# Altium schematic sheet Key.SchDoc
size A4
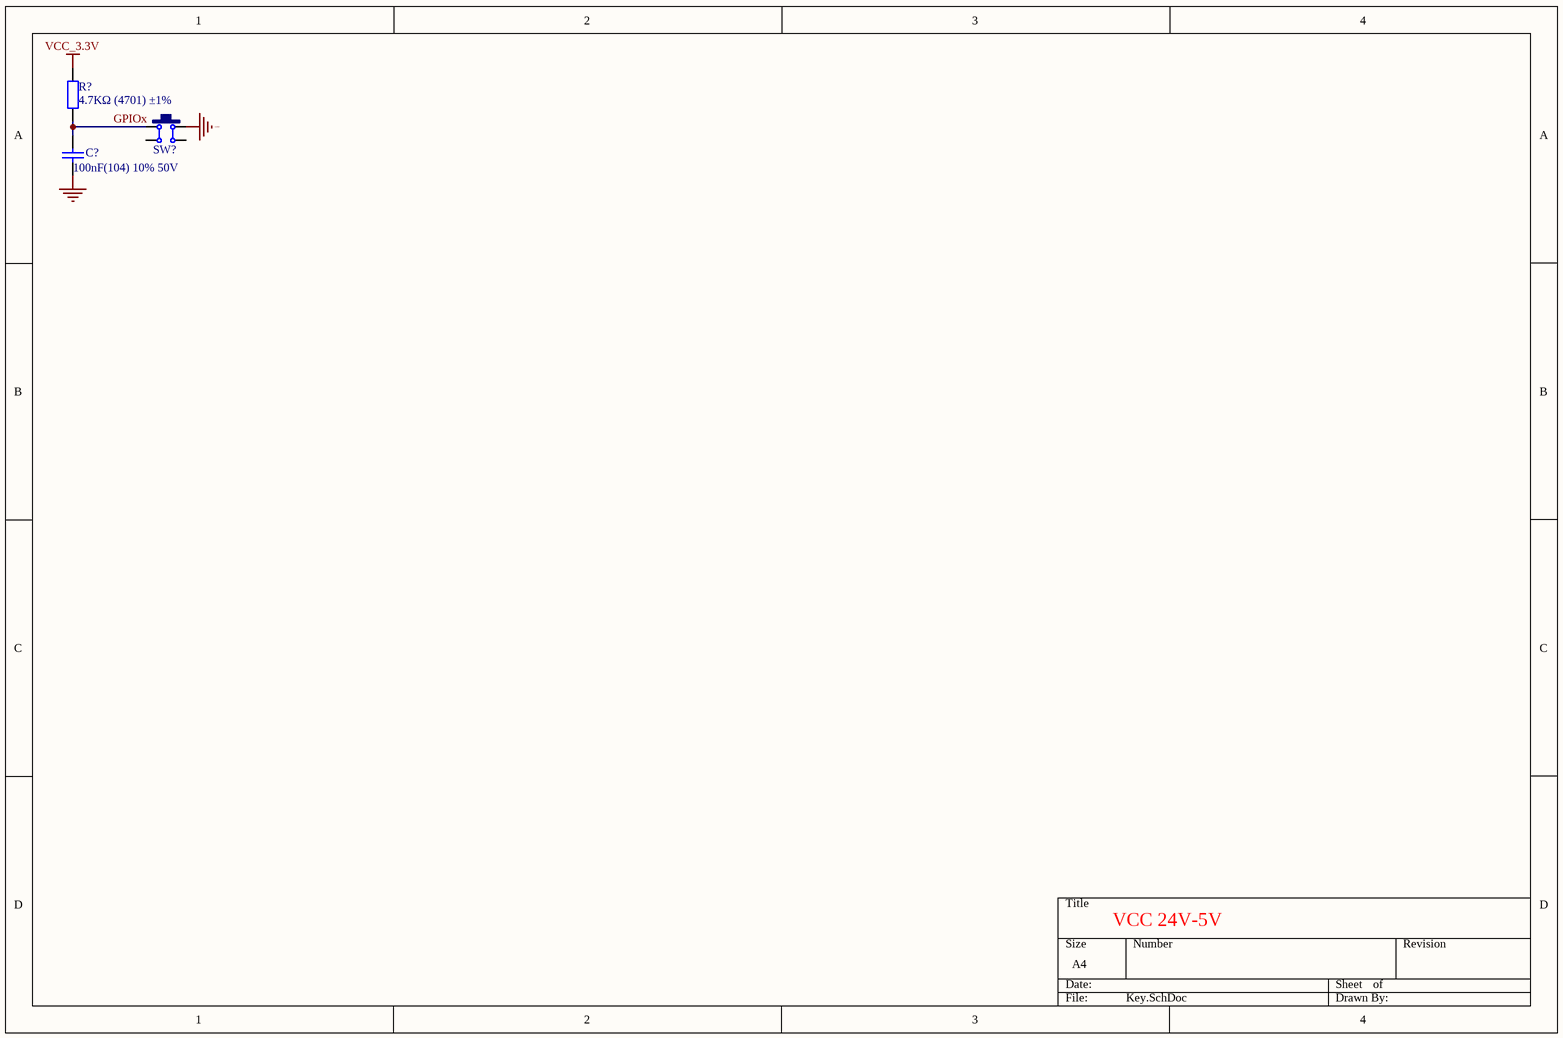
[diagram p0: Key.SchDoc]

## Parts
C?  100nF(104) 10% 50V  [0805_C]
R?  4.7KΩ (4701) ±1%  [RESC_0805]
SW?  SW_PB_12X12X4.3  [SW_PB_12X12X4.3]  (value not drawn)

## Nets
GND: C?.1 SW?.2
VCC_3.3V: R?.2
GPIOx: C?.2 R?.1 SW?.1

Not connected (* = marked no-connect by the designer): SW? 3 4

## Notes on the sheet
- VCC 24V-5V

## Library data of the parts
C? = 0805 100nF(104) 10% 50V: 贴片电容; ComponentLink1Description: 供应商链接; ComponentLink1URL: http://www.szlcsc.com/product/details_50686.html; Package: 0805; Supplier: LC; SuppliersPartNumber: C49678
R? = 0805 4.7KΩ (4701) ±1%: 贴片电阻; ComponentLink1Description: 供应商链接; ComponentLink1URL: http://www.szlcsc.com/product/details_18317.html; Package: 0805; Supplier: LC; SuppliersPartNumber: C17673
SW? = TSW DIP-6x6: 直插6x6轻触开关